# Altium schematic sheet PWR_Config.SchDoc: System Power and Configuration
size B; Author: Michael Jones; Engineer: Michael Jones; Organization: Group VIII Technology; Address1: 1652 W 820 N; Address2: Provo; Address3: UT  84601; Address4: 801-379-0118; DocumentNumber: 2; Revision: A3; SheetNumber: 2; SheetTotal: 6
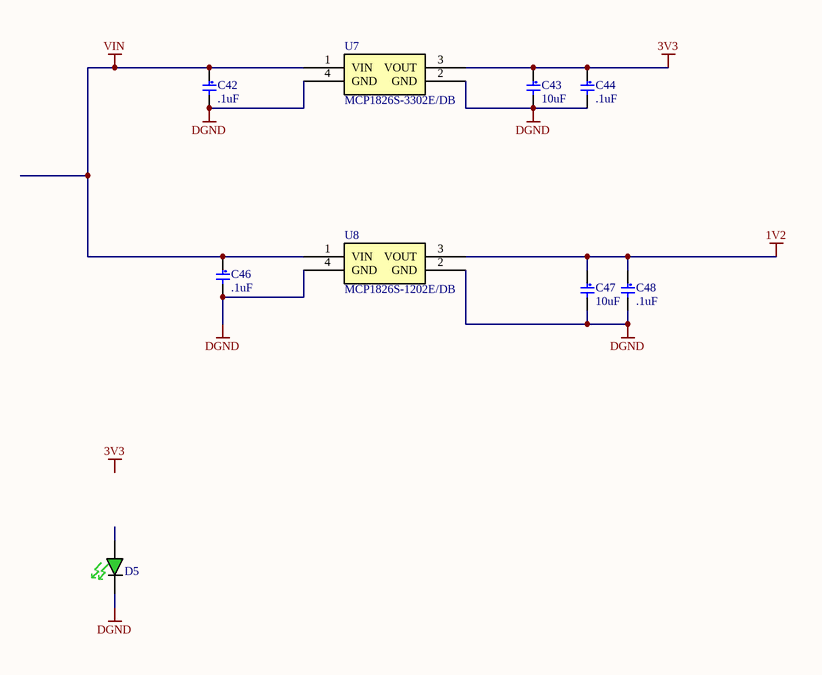
[diagram p0: PWR_Config.SchDoc]

## Parts
C42  .1uF  [C0603]
C43  10uF  [CAPC2012X06N-0805]
C44  .1uF  [C0603]
C46  .1uF  [C0603]
C47  10uF  [CAPC2012X06N-0805]
C48  .1uF  [C0603]
D5  APT1608CGCK  [DIOM1608X08N_0603_A-C]  (value not drawn)
U7  MCP1826S-3302E/DB  [SOT223]
U8  MCP1826S-1202E/DB  [SOT223]

## Nets
1V2: C47.1 C48.1 U8.3(VOUT)
3V3: C43.1 C44.1 U7.3(VOUT)
DGND: C42.2 C43.2 C44.2 C46.2 C47.2 C48.2 D5.C U7.2(GND) U7.4(GND) U8.2(GND) U8.4(GND)
VIN: C42.1 C46.1 U7.1(VIN) U8.1(VIN)

Not connected (* = marked no-connect by the designer): D5 A

## Notes on the sheet
- Labels drawn without touching a wire or pin: 3V3
- 2
- Wavenumber
- pl
- -1
- Rev:
- Technologies
- Sheet
- of

## Library data of the parts
C42-C44 C46-C48 = Cap-Eli: CAP CER .1UF 50V 10% X7R 0603; Manufacturer: Murata Electronics North America; Manufacturer Part Number: GRM188R71H104KA93D; Capacitance: 0.1µF; Supplier 1: Digi-Key; Supplier Part Number 1: 490-1519-1-ND; RoHS: RoHS Compliant; Category: Capacitors; Stock 1: 9370695; Pricing 1: 10=0.037, 100=0.0221, 500=0.01276, 1000=0.00884 (USD); Voltage - Rated: 50V; Tolerance: ±10%; Temperature Coefficient: X7R; Mounting Type: Surface Mount, MLCC; Operating Temperature: -55°C ~ 125°C; Features: -; Applications: General Purpose; Ratings: -; Package / Case: 0603 (1608 Metric); Size / Dimension: 0.063" L x 0.031" W (1.60mm x 0.80mm); Lead Spacing: -; Thickness: 0.80mm; Packaging: Cut Tape (CT); Lead Style: -; ComponentLink1URL: http://search.murata.co.jp/Ceramy/image/img/PDF/ENG/GRM188R71H104KA93.pdf; ComponentLink1Description: http://search.murata.co.jp/Ceramy/image/img/PDF/ENG/GRM188R71H104KA93.pdf
  C42 C44 C46 C48: Value: .1uF
  C43 C47: Value: 10uF
D5 = LED_GREEN: LED 1.6X0.8MM 570NM GRN CLR SMD; Manufacturer: Kingbright Corp; Color: Green; Current - Test: 20mA; Wavelength - Peak: 574nm; Millicandela Rating: 50mcd; Voltage - Forward (Vf) Typ: 2.1V; Lens Type: Clear; Lens Style/Size: Rectangle, 1.2mm x 0.8mm; Viewing Angle: 120°; Value: APT1608CGCK; Supplier 1: Digi-Key; Supplier Part Number 1: 754-1116-2-ND; Manufacturer Part Number: APT1608CGCK; RoHS: RoHS Compliant; Category: Optoelectronics; Stock 1: 94000; Pricing 1: 2000=0.051, 6000=0.045, 10000=0.043 (USD); Luminous Flux @ Current - Test: -; Wavelength - Dominant: 570nm; Size / Dimension: 1.60mm L x 0.80mm W; Height: 0.75mm; Package / Case: 0603 (1608 Metric); Mounting Type: Surface Mount; Packaging: Tape & Reel (TR); ComponentLink1URL: http://www.us.kingbright.com/images/catalog/SPEC/APT1608CGCK.pdf; ComponentLink1Description: http://www.us.kingbright.com/images/catalog/SPEC/APT1608CGCK.pdf
U7 = MCP1826S-3302E/DB: IC LDO REG 1A 3.3V SOT223-3; Manufacturer: Microchip Technology; Regulator Topology: Positive Fixed; Voltage - Input: Up to 6V; Voltage - Dropout (Typical): 0.25V @ 1A; Number of Regulators: 1; Current - Output: 1A (Min); Value: MCP1826S-3302E/DB; Supplier 1: Digi-Key; Supplier Part Number 1: MCP1826S-3302E/DB-ND; Manufacturer Part Number: MCP1826S-3302E/DB; RoHS: RoHS Compliant; Category: Integrated Circuits (ICs); Stock 1: 2041; Pricing 1: 1=0.74, 10=0.68, 25=0.57, 100=0.52 (USD); Voltage - Output: 3.3V; Current - Limit (Min): -; Operating Temperature: -40°C ~ 125°C; Mounting Type: Surface Mount; Package / Case: TO-261-4, TO-261AA; Supplier Device Package: SOT-223-3; Packaging: Tube; ComponentLink1URL: http://ww1.microchip.com/downloads/en/DeviceDoc/22057a.pdf; ComponentLink1Description: http://ww1.microchip.com/downloads/en/DeviceDoc/22057a.pdf
U8 = MCP1826S-1202E/DB: IC LDO REG 1A 1.2V SOT223-3; Manufacturer: Microchip Technology; Regulator Topology: Positive Fixed; Voltage - Input: Up to 6V; Voltage - Dropout (Typical): 0.25V @ 1A; Number of Regulators: 1; Current - Output: 1A (Min); Value: MCP1826S-1202E/DB; Supplier 1: Digi-Key; Supplier Part Number 1: MCP1826S-1202E/DB-ND; Manufacturer Part Number: MCP1826S-1202E/DB; RoHS: RoHS Compliant; Category: Integrated Circuits (ICs); Stock 1: 2041; Pricing 1: 1=0.74, 10=0.68, 25=0.57, 100=0.52 (USD); Voltage - Output: 1.2V; Current - Limit (Min): -; Operating Temperature: -40°C ~ 125°C; Mounting Type: Surface Mount; Package / Case: TO-261-4, TO-261AA; Supplier Device Package: SOT-223-3; Packaging: Tube; ComponentLink1URL: http://ww1.microchip.com/downloads/en/DeviceDoc/22057a.pdf; ComponentLink1Description: http://ww1.microchip.com/downloads/en/DeviceDoc/22057a.pdf